# Altium project GUN.PrjPcb (part 1 of 2)
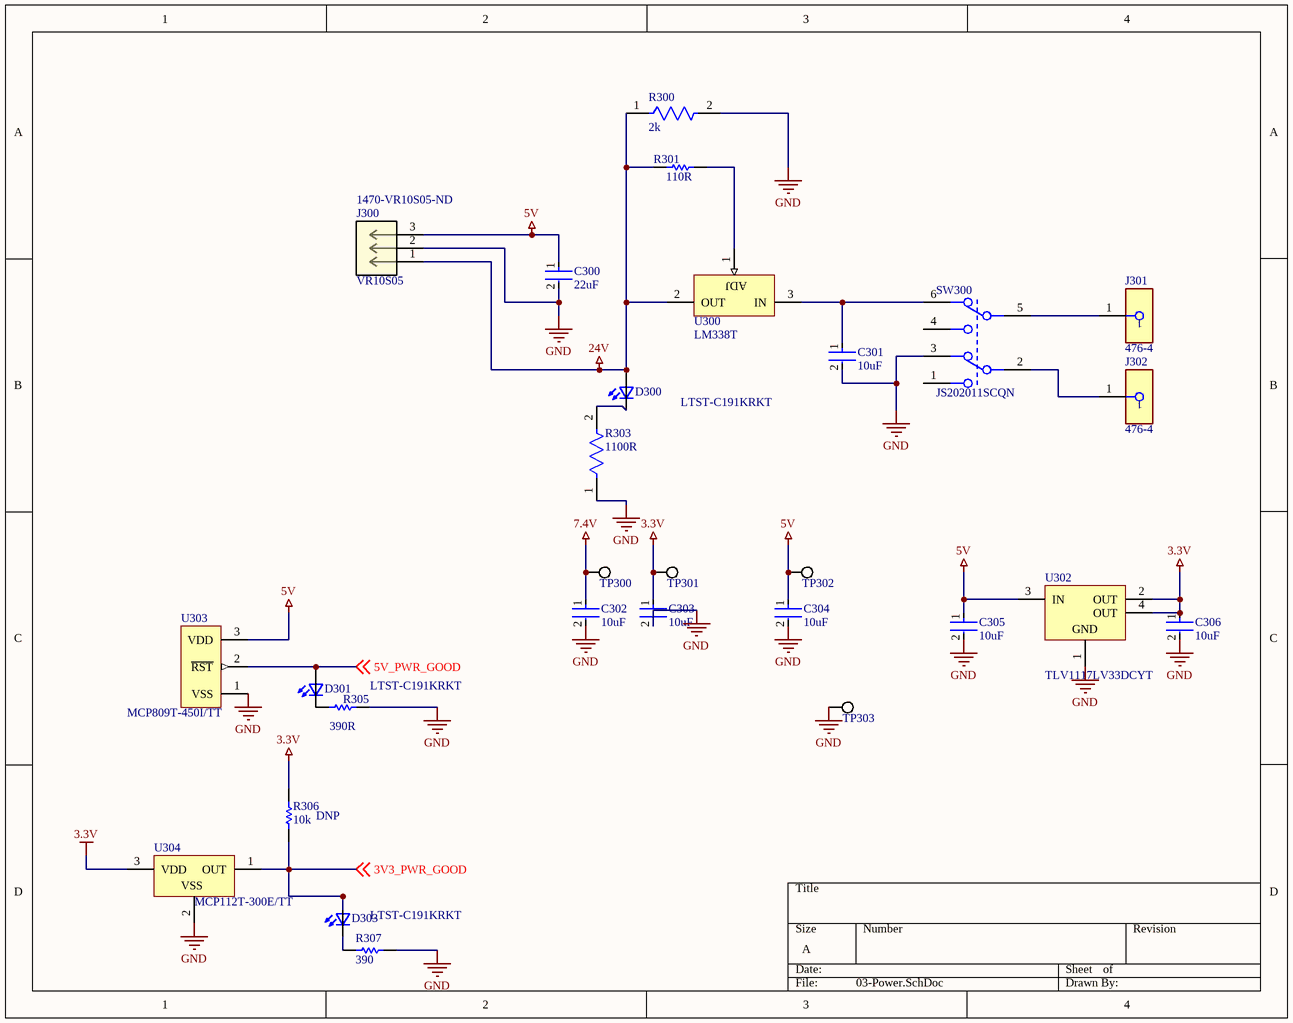
[diagram p0: 03-Power.SchDoc]
8 sheets, 146 parts. Net scope: flat (ports and power ports of the same name join across sheets).
Board file: GunPCB1.PcbDoc
Sheets:
  03-Power.SchDoc
  01-Revision_History_and_Contents.SchDoc
  02-MCU.SchDoc
  04-HallEffectSensor.SchDoc
  05-StepperMotor.SchDoc
  06-ServoMotor.SchDoc
  07-UARTBridge.SchDoc
  08-SwitchingRegulator.SchDoc

## Sheet 03-Power.SchDoc
size A

### Parts
C300  22uF  [FP-GRM21B-0_15-MFG]
C301  10uF  [FP-C0805C-DG-MFG]
C302  10uF  [FP-C0805C-DG-MFG]
C303  10uF  [FP-C0805C-DG-MFG]
C304  10uF  [FP-C0805C-DG-MFG]
C305  10uF  [FP-C0805C-DG-MFG]
C306  10uF  [FP-C0805C-DG-MFG]
D300  LTST-C191KRKT  [0603]
D301  LTST-C191KRKT  [0603]
D303  LTST-C191KRKT  [0603]
J300  VR10S05  Supplier Part Number 1: 1470-VR10S05-ND  [CONN3_10S05_XPP]
J301  476-4  [FP-476-4-MFG]
J302  476-4  [FP-476-4-MFG]
R300  2k  [FP-CRCW0805-e3-IPC_B]
R301  110R  [RESC2013X60X40NL20T25]
R303  1100R  [FP-ESR10-MFG]
R305  390R  [RESC3216X70X50LL05T20]
R306  10k  [RESC2013X60X35ML10T20]
R307  390  [RESC3216X70X50LL05T20]
SW300  JS202011SCQN  [FP-JS202011SCQN-MFG]
TP300  5019  [KSTN-5019_V]  (value not drawn)
TP301  5019  [KSTN-5019_V]  (value not drawn)
TP302  5019  [KSTN-5019_V]  (value not drawn)
TP303  5019  [KSTN-5019_V]  (value not drawn)
U300  LM338T  [NDE0003A]
U302  TLV1117LV33DCYT  [DCY0004A_M]
U303  MCP809T-450I/TT  [SOT-23-TT3_N]
U304  MCP112T-300E/TT  [SOT-23-TT3_L]

### Nets
3.3V: C303.1 C306.1 R306.2 TP301.1 U302.2(OUT) U302.4(OUT) U304.3(VDD)
5V: C300.1 C304.1 C305.1 J300.3 TP302.1 U302.3(IN) U303.3(VDD)
7.4V: C302.1 TP300.1
24V: D300.2(A2) J300.1 R300.1 R301.1 U300.2(OUT)
GND: C300.2 C301.2 C302.2 C303.2 C304.2 C305.2 C306.2 J300.2 R300.2 R303.1 R305.2 R307.1 SW300.3 TP303.1 U302.1(GND) U303.1(VSS) U304.2(VSS)
3V3_PWR_GOOD: D303.2(A2) R306.1 U304.1(OUT) ; off-sheet 3V3_PWR_GOOD
5V_PWR_GOOD: D301.2(A2) U303.2(~{RST}) ; off-sheet 5V_PWR_GOOD
NetC301_1: C301.1 SW300.6 U300.3(IN)
NetD300_1: D300.1(K2) R303.2
NetD301_1: D301.1(K2) R305.1
NetD303_1: D303.1(K2) R307.2
NetJ301_1: J301.1 SW300.5
NetJ302_1: J302.1 SW300.2
NetR301_2: R301.2 U300.1(ADJ)

Not connected (* = marked no-connect by the designer): SW300 1 4

### Notes on the sheet
- (near R306) DNP

### Library data of the parts
C300 = CMP-2007-03385-2: Manufacturer: Murata; Manufacturer Part Number: GRM21BR60J226ME39L; Material: Ceramic; Voltage: 6.3V; Dielectric: X5R; Tolerance: 20%; Max Operating Temperature: 85°C; Min Operating Temperature: -55°C; Case/Package: 0805; Thickness: 0.053inch; Packaging: Tape and Reel; Depth: 1.25mm; Termination: SMD/SMT; Voltage Rating (DC): 6.3V; Radiation Hardening: No; Mount: Surface Mount; Lead Free: Lead Free; Package Quantity: 1; REACH SVHC: No SVHC; Voltage Rating: 6.3V; Capacitance: 22uF; Length: 2mm; Case Code (Imperial): 0805; Case Code (Metric): 2012; Width: 0.049inch; Height: 1.25mm; Supplier 1: Digi-Key; Supplier Part Number 1: 490-1719-1-ND; RoHS: Yes; Category: Ceramic Capacitors; Stock 1: 2705091; Pricing 1: 1=0.37000, 10=0.25600, 50=0.17940, 100=0.15380, 500=0.11532, 1000=0.09739 (USD); Series: GRM; Construction: Flat; RoHS Compliant: Yes; Reach SVHC Compliant: Yes
C301-C306 = CMP-2007-03243-2: Manufacturer Part Number: C0805C106K8PACTU; Manufacturer: Kemet; 3DS Part Number: 220-00001; Tolerance: 10%; Temperature Coefficient: 15%; Material: Ceramic; Voltage: 10V; Temperature Characteristic: X5R; Device Class L2: Capacitors; Device Class L1: Passive Components; ComponentLink2URL: https://content.kemet.com/datasheets/KEM_C1006_X5R_SMD.pdf; Height: 1.4mm; Lead Free: Yes; Digikey Description: CAP CER 10UF 10V X5R 0805; Octopart: https://octopart.com/c0805c106k8pactu-kemet-98697; Capacitance: 10uF; Value: 10uF; Temperature Range Low: -55°C; Temperature: -55°C to +85°C; Automotive: No; Mouser Description: CAP CER 10UF 10V X5R 0805; Ipc Land Pattern Name: CAPC200125X125; Temperature Range High: +85°C; RoHS: TRUE; Device Class L3: Ceramic Capacitors; ComponentLink2Description: Datasheet; Voltage Rating: 10V; Package: C0805C-DG; Category: Cap
D300 D301 D303 = LTST-C191KRKT: http://octopart.com/ltst-c190krkt-lite-on-549893; Package: None; MP: LTST-C191KRKT; Value: *; Availability: Unavailable; Price: None; Supplier 1: Digi-Key; Supplier Part Number 1: 160-1447-1-ND
J300 = VR10S05: DC-DC Converter, Switching Regulater, 1A, SIP, VR Series; Mfr_Name: XP Power; RefDes: RefDes; Type: Type; Supplier 1: Digi-Key; Manufacturer: XP Power; Manufacturer Part Number: VR10S05; RoHS: No; Category: Board Mount Modules; Stock 1: 1761; Pricing 1: 1=2.85000, 5=2.76400, 10=2.67900, 25=2.56480, 100=2.39400 (USD)
J301 J302 = CMP-19636-000003-1: PLUG JACK MINI NON-INSULATED; Manufacturer: Keystone Electronics; Is Female: yes; Number Of Contacts: 1; Current Rating: 10A; Conn Orientation: Straight; Device Class L1: Connectors; Category: Conn; ComponentLink2Description: Datasheet; Lead Free: Yes; Device Class L3: unset; Package: 476-4; RoHS: TRUE; Contact Material: Tin; Footprint Url: https://www.keyelco.com/product-pdf.cfm?p=2378; Mouser Description: Test Plugs & Test Jacks BANANA JACK NON-INSUL; Octopart: https://octopart.com/476-4-keystone-225161; Device Class L2: unset; Manufacturer Part Number: 476-4; ComponentLink2URL: https://www.keyelco.com/userAssets/file/M65p111.pdf; Digikey Description: PLUG JACK MINI NON-INSULATED; Automotive: No
R300 = CMP-2001-03755-2: RES Thick Film, 2kΩ, 1%, 0.125W, 100ppm/°C, 0805; Working Voltage: 150V; Max Power Dissipation: 125mW; Resistance: 2kR; Package Quantity: 10; Case Code (Metric): 2012; Voltage Rating: 150V; Number of Terminations: 2; Max Operating Temperature: 155°C; Depth: 1.25mm; Tolerance: 1%; Power Rating: 125mW; Lead Free: Lead Free; Case/Package: 0805; Features: Automotive AEC-Q200; Min Operating Temperature: -55°C; Termination: SMD/SMT; Case Code (Imperial): 0805; Weight: 0.000194oz; Packaging: Tape and Reel; Military Standard: Not; Radiation Hardening: No; Contact Plating: Tin; Mount: Surface Mount; Temperature Coefficient: 100ppm/°C; Height: 0.02inch; Number of Terminals: 2; Voltage Rating (DC): 150V; Number of Pins: 2; Length: 2mm; Width: 1.25mm; Composition: Thick Film
R301 = CMP-2001-00585-1: Part Number: ERA6AEB111V; Manufacturer: Panasonic
R303 = CMP-08839-007508-1: 1.1kΩ ±1% 0.4W 0805 Anti-Surge Chip Resistor AEC-Q200; Max Power Dissipation: 400mW; Temperature Coefficient: 100ppm/°C; Resistance: 1.1kR; Size Code: 0805; Case/Package: 0805; Resistor Type: Thick Film; Lead Free: Lead Free; Max Operating Temperature: 155°C; Package Quantity: 1; Power Rating: 400mW; Series: ESR; Number of Terminations: 2; Height: 0.026inch; Features: Automotive AEC-Q200; Case Code (Metric): 2012; Width: 0.049inch; Length: 0.079inch; Tolerance: 1%; Case Code (Imperial): 0805; Packaging: Tape and Reel; RoHS Compliant: Yes; Min Operating Temperature: -55°C
R305 R307 = CMP-1014-00463-2: Manufacturer: Panasonic; Part Number: ERJ8ENF3900V
R306 = CMP-2000-05025-1: Chip Resistor, 10 KOhm, +/- 5%, 0.125 W, -55 to 155 degC, 0805 (2012 Metric), RoHS, Tape and Reel; Manufacturer: Yageo; Resistor Element Type: ThickFilm; Voltage Rating: 150V; Product Range: RCSeries; SVHC: ToBeAdvised; Resistor Case Style: 0805[2012Metric]; Temperature Coefficient: ±100ppm/degC; Power Rating: 250mW; Resistance: 10kohm; Automotive Qualification Standard: -; Datasheet Version: REV. 2, 09/2004; Packaging: CutTape; Resistance Tolerance: ±5%; MSL: MSL1-Unlimited; Manufacturer URL: http://www.yageo.com/; Datasheet URL: http://www.yageo.ru/pdf/RC0805.pdf; Package Description: 2-Pin Surface Mounted Device, Body 2 x 1.25 mm; Package Reference: 805
SW300 = CMP-2000-05087-3: SWITCH SLIDE DPDT 300MA 6V; Switch Function: On-On; Actuator Type: Standard; Switch Travel: 2mm; Actuator Color: Black; Contact Resistance: 70mR; Electrical Life: 5000Cycles; Actuator Material: Nylon; REACH SVHC: No SVHC; Series: JS; Min Operating Temperature: -20°C; Depth: 7.5mm; Housing Material: Nylon; Voltage Rating (DC): 6V; Max Operating Temperature: 85°C; Contact Current Rating: 300mA; Package Quantity: 1; Contact Plating: Silver; Contact Material: Copper Alloy; Throw Configuration: DPDT; Current Rating: 300mA; Orientation: Vertical; Max Current Rating: 300mA; Max Voltage Rating (DC): 6V; Flammability Rating: UL94 V-2; Length: 9mm; Packaging: Tape and Reel; Mount: Surface Mount; Actuator Length: 2mm; Lead Free: Lead Free; Termination: Gull Wing; Radiation Hardening: No
TP300-TP303 = CMP-1672-00008-1: Test Point, 1 Position SMD, RoHS, Tape and Reel; Manufacturer 1: Keystone Electronics; ComponentLink1Description: Manufacturer URL; Package Quantity: 1000; DatasheetVersion: 03/2014; Packaging: Tape and Reel; ComponentLink2URL: http://www.keyelco.com/product-pdf.cfm?p=1357; ComponentLink1URL: http://www.keyelco.com/; Mount: Surface Mount; Contact Plating: Silver; PackageDescription: 1-Pin Surface Mount Device, Body 3.81 x 2.03 mm; Pins: 1; RoHSCompliant: True; Mounting Technology: Surface Mount; ComponentLink2Description: Datasheet; PackageReference: 5019; Supplier 1: Digi-Key; Supplier Part Number 1: 36-5019CT-ND; Manufacturer Part Number 1: 5019; RoHS: Yes; Category: Connectors; Stock 1: 1316816; Pricing 1: 1=0.34000, 25=0.27360, 100=0.22340, 250=0.20064, 500=0.19152 (USD); Number of Pins: 1; Material: Bronze; Contact Material: Bronze; Series: 5019; Termination: SMD/SMT; Height: 0.09inch; RoHS Compliant: Yes; REACH SVHC: No SVHC; Lead Free: Lead Free; ComponentLink3URL: https://datasheet.ciiva.com/16318/m60-2p61-16318395.pdf?src-supplier=Future+Electronics; ComponentLink3Description: https://datasheet.ciiva.com/16318/m60-2p61-16318395.pdf?src-supplier=Future+Electronics; ComponentLink4URL: https://datasheet.ciiva.com/16885/70182998-16885945.pdf?src-supplier=Allied+Electronics; ComponentLink4Description: https://datasheet.ciiva.com/16885/70182998-16885945.pdf?src-supplier=Allied+Electronics; ComponentLink5URL: https://datasheet.ciiva.com/14848/m60-2p61-14848437.pdf?src-supplier=Digi-Key; ComponentLink5Description: https://datasheet.ciiva.com/14848/m60-2p61-14848437.pdf?src-supplier=Digi-Key; ComponentLink6URL: https://datasheet.ciiva.com/14848/m60-2p61-14848438.pdf?src-supplier=Digi-Key; ComponentLink6Description: https://datasheet.ciiva.com/14848/m60-2p61-14848438.pdf?src-supplier=Digi-Key; ComponentLink7URL: https://datasheet.ciiva.com/14848/m60-2p61-14848439.pdf?src-supplier=Digi-Key; ComponentLink7Description: https://datasheet.ciiva.com/14848/m60-2p61-14848439.pdf?src-supplier=Digi-Key
U300 = CMP-0062-02475-3: 5 Amp Adjustable Regulator, 3-pin TO-220; Manufacturer: Texas Instruments; PowerWise: N; PackageTopMarking: NSUZXYTTE#*LM338T P+; CompType: LDO IC; RoHS: N; PackageDescription: TO-220, Molded, 3 Lead, Straight; PinCount: 3; ComponentLink1URL: http://www.ti.com/general/docs/lit/getliterature.tsp?genericPartNumber=LM338&fileType=pdf; ComponentLink1Description: Datasheet URL; PackageReference: NDE0003A
U302 = CMP-0395-00499-2: Single Output LDO, 1 A, Fixed 3.3 V Output, 2 to 5.5 V Input, 4-pin SOT-223 (DCY), -40 to 125 degC, Green (RoHS & no Sb/Br); Manufacturer: Texas Instruments; Vout Adj(Max)(V): 3.3; Iout(Max)(A): 1; SubFamily: Single Channel LDO; Iq(Typ)(mA): 0.05; Accuracy(%): 2; Vin(Max)(V): 5.5; Vdo(Typ)(mV): 1200; PartNumber: TLV1117LV33DCYT; PackageReference: DCY0004A; PackageVersion: 4202506/B; ComponentLink1URL: http://www.ti.com/; DatasheetVersion: SBVS160A; Mounting Technology: Surface Mount; Fixed Output Options(V): 3.3; ComponentLink3Description: Package Specification; PackageDescription: 4-Pin Plastic Small Outline, Body 3.5 x 6.5 mm, Pitch 2.3 mm; Vout Adj(Min)(V): 3.3; ComponentLink2URL: http://www.ti.com/general/docs/lit/getliterature.tsp?genericPartNumber=TLV1117LV33&fileType=pdf; Code_JEDEC: TO-261; ComponentLink1Description: Manufacturer URL; Vin(Min)(V): 2; ComponentLink2Description: Datasheet; Eco-Plan: Green (RoHS & no Sb/Br); ComponentLink3URL: http://www.ti.com/litv/pdf/mpds094a
U303 = CMP-0138-00383-1: Microcontroller Supervisory Circuit with Push-Pull Output, 3-Pin SOT-23, Industrial Temperature, Tape and Reel; DatasheetVersion: revC, 2001; PackageReference: SOT-23-TT3; Code_IPC: SOT23-3; PackageVersion: revBB, Aug-2009; PackageDescription: 3-Lead Plastic Small Outline Transistor (TT) [SOT-23]
U304 = CMP-0130-00043-1: 1.75Î¼A Micropower Voltage Detector, Push-Pull Output, 2.93V, 3-Pin SOT-23, Extended Temperature, Tape and Reel; Code_IPC: SOT23-3; DatasheetVersion: revD, Jun-2005; PackageVersion: revBB, Aug-2009; PackageDescription: 3-Lead Plastic Small Outline Transistor (TT) [SOT-23]; PackageReference: SOT-23-TT3

## Sheet 01-Revision_History_and_Contents.SchDoc: Revision History and Contents
size A; Date: 4/25/2017; ApprovedBy: JSK; CheckedBy: JSK; Author: JSK; CompanyName: University of Wisconsin; DrawnBy: JSK; Engineer: JSK; Organization: ECE 315; Address1: College of Engineering; Address2: 1415 Engineering Drive; Address3: Madison, WI 53706; Address4: ECE 453 Spring 2017; Revision: A; SheetNumber: 1; SheetTotal: 2
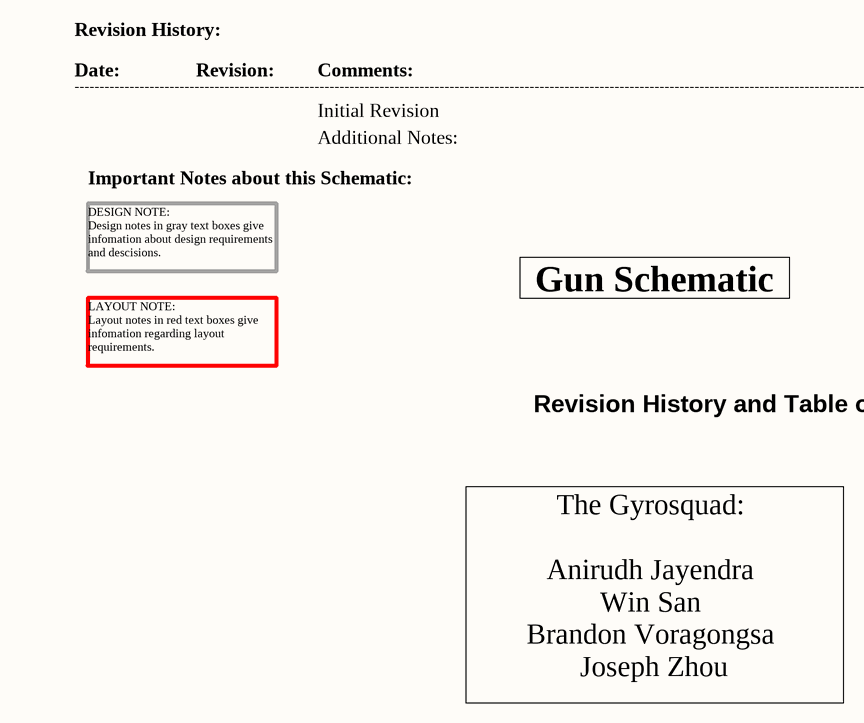
[diagram p1: 01-Revision_History_and_Contents.SchDoc]

### Notes on the sheet
- Revision History:
- Date:
- ----------------------------------------------------------------------------------------------------------------------------------------------------------------------
- Revision:
- Comments:
- Initial Revision
- Important Notes about this Schematic:
- Additional Notes:
- DESIGN NOTE:
  Design notes in gray text boxes give infomation about design requirements and descisions.
- Gun Schematic
- LAYOUT NOTE:
  Layout notes in red text boxes give infomation regarding layout requirements.
- Revision History and Table of Contents
- The Gyrosquad:
  Anirudh Jayendra
  Win San
  Brandon Voragongsa
  Joseph Zhou

## Sheet 02-MCU.SchDoc: ECE453 Power
size A; Date: 4/25/2017; ApprovedBy: JSK; CheckedBy: JSK; Author: JSK; CompanyName: University of Wisconsin; DrawnBy: JSK; Engineer: JSK; Organization: ECE 315; Address1: College of Engineering; Address2: 1415 Engineering Drive; Address3: Madison, WI 53706; Address4: ECE 453 Fall 2022; Revision: A; SheetNumber: 2; SheetTotal: 2; AssemblyNumber: ECE453-F22-01
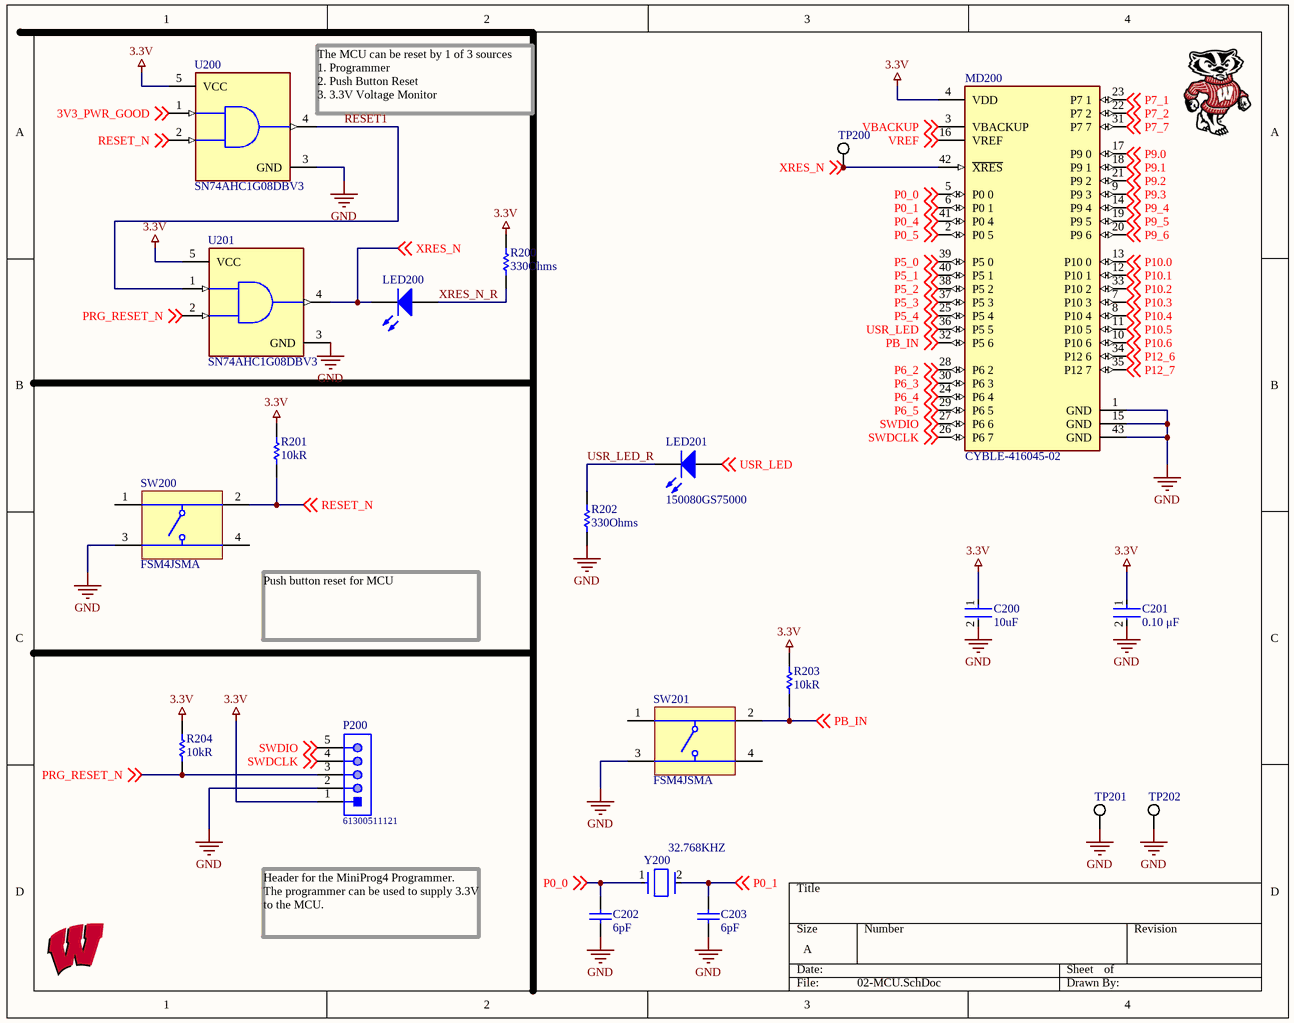
[diagram p2: 02-MCU.SchDoc]

### Parts
C200  value 10uF  [FP-C0805C-DG-MFG]  (hidden comment: C0805C106K8PACTU)
C201  value 0.10 μF  [FP-C0805C-DN-MFG]  (hidden comment: C0805C104K5RACTU)
C202  Capacitance: 6pF  [CAPC2013X94X50LL20T25]  (hidden comment: 08055A6R0CAT2A)
C203  Capacitance: 6pF  [CAPC2013X94X50LL20T25]  (hidden comment: 08055A6R0CAT2A)
LED200  150080RS75000  [0805_A]  (value not drawn)
LED201  150080GS75000  [0805_A]
MD200  CYBLE-416045-02  [FP-CYBLE-416045-02-MFG]
P200  61300511121  [61300511121]
R200  Resistance: 330Ohms  [RESC2013X60X35LL10T20]  (hidden comment: RC0805FR-07330RL)
R201  Resistance: 10kR  [RESC2013X60X35NL10T20]  (hidden comment: RC0805FR-0710KL)
R202  Resistance: 330Ohms  [RESC2013X60X35LL10T20]  (hidden comment: RC0805FR-07330RL)
R203  Resistance: 10kR  [RESC2013X60X35NL10T20]  (hidden comment: RC0805FR-0710KL)
R204  Resistance: 10kR  [RESC2013X60X35NL10T20]  (hidden comment: RC0805FR-0710KL)
SW200  FSM4JSMA  [TECO-FSM4JSMA_V]
SW201  FSM4JSMA  [TECO-FSM4JSMA_V]
TP200  5019  [KSTN-5019_V]  (value not drawn)
TP201  5019  [KSTN-5019_V]  (value not drawn)
TP202  5019  [KSTN-5019_V]  (value not drawn)
U200  SN74AHC1G08DBV3  [FP-DBV0005A-IPC_C]
U201  SN74AHC1G08DBV3  [FP-DBV0005A-IPC_C]
Y200  32.768KHZ  [FP-ABS07-120-MFG]

### Nets
3.3V: C200.1 C201.1 MD200.4(VDD) P200.1 R200.2 R201.2 R203.2 R204.2 U200.5(VCC) U201.5(VCC)
GND: C200.2 C201.2 C202.1 C203.1 MD200.1(GND) MD200.15(GND) MD200.43(GND) P200.2 R202.1 SW200.3 SW201.3 TP201.1 TP202.1 U200.3(GND) U201.3(GND)
3V3_PWR_GOOD: U200.1(A) ; off-sheet 3V3_PWR_GOOD
P0_0: C202.2 MD200.5(P0_0) Y200.1 ; off-sheet P0_0
P0_1: C203.2 MD200.6(P0_1) Y200.2 ; off-sheet P0_1
P0_4: MD200.41(P0_4) ; off-sheet P0_4
P0_5: MD200.2(P0_5) ; off-sheet P0_5
P5_0: MD200.39(P5_0) ; off-sheet P5_0
P5_1: MD200.40(P5_1) ; off-sheet P5_1
P5_2: MD200.38(P5_2) ; off-sheet P5_2
P5_3: MD200.37(P5_3) ; off-sheet P5_3
P5_4: MD200.25(P5_4) ; off-sheet P5_4
P6_2: MD200.28(P6_2) ; off-sheet P6_2
P6_3: MD200.30(P6_3) ; off-sheet P6_3
P6_4: MD200.24(P6_4) ; off-sheet P6_4
P6_5: MD200.29(P6_5) ; off-sheet P6_5
P7_1: MD200.23(P7_1) ; off-sheet P7_1
P7_2: MD200.22(P7_2) ; off-sheet P7_2
P7_7: MD200.31(P7_7) ; off-sheet P7_7
P9.0: MD200.17(P9_0) ; off-sheet P9.0
P9.1: MD200.18(P9_1) ; off-sheet P9.1
P9.2: MD200.21(P9_2) ; off-sheet P9.2
P9.3: MD200.9(P9_3) ; off-sheet P9.3
P9_4: MD200.14(P9_4) ; off-sheet P9_4
P9_5: MD200.19(P9_5) ; off-sheet P9_5
P9_6: MD200.20(P9_6) ; off-sheet P9_6
P10.0: MD200.13(P10_0) ; off-sheet P10.0
P10.1: MD200.12(P10_1) ; off-sheet P10.1
P10.2: MD200.33(P10_2) ; off-sheet P10.2
P10.3: MD200.7(P10_3) ; off-sheet P10.3
P10.4: MD200.8(P10_4) ; off-sheet P10.4
P10.5: MD200.11(P10_5) ; off-sheet P10.5
P10.6: MD200.10(P10_6) ; off-sheet P10.6
P12_6: MD200.34(P12_6) ; off-sheet P12_6
P12_7: MD200.35(P12_7) ; off-sheet P12_7
PB_IN: MD200.32(P5_6) R203.1 SW201.2 ; off-sheet PB_IN
PRG_RESET_N: P200.3 R204.1 U201.2(B) ; off-sheet PRG_RESET_N
RESET1: U200.4(Y) U201.1(A)
RESET_N: R201.1 SW200.2 U200.2(B) ; off-sheet RESET_N
SWDCLK: MD200.26(P6_7) P200.4 ; off-sheet SWDCLK
SWDIO: MD200.27(P6_6) P200.5 ; off-sheet SWDIO
USR_LED: LED201.2(A) MD200.36(P5_5) ; off-sheet USR_LED
USR_LED_R: LED201.1(K) R202.2
VBACKUP: MD200.3(VBACKUP) ; off-sheet VBACKUP
VREF: MD200.16(VREF) ; off-sheet VREF
XRES_N: LED200.1(K) MD200.42(~{XRES}) TP200.1 U201.4(Y) ; off-sheet XRES_N
XRES_N_R: LED200.2(A) R200.1

Not connected (* = marked no-connect by the designer): SW200 1 4; SW201 1 4

### Notes on the sheet
- (near U200) The MCU can be reset by 1 of 3 sources
  1. Programmer
  2. Push Button Reset
  3. 3.3V Voltage Monitor
- (near SW200) Push button reset for MCU
- Header for the MiniProg4 Programmer.  The programmer can be used to supply 3.3V to the MCU.

### Library data of the parts
C200 = CMP-2007-03243-2: CAP CER 10UF 10V X5R 0805; Manufacturer: Kemet; 3DS Part Number: 220-00001; Tolerance: 10%; Temperature Coefficient: 15%; Material: Ceramic; Device Class L2: Capacitors; Device Class L1: Passive Components; ComponentLink2URL: https://content.kemet.com/datasheets/KEM_C1006_X5R_SMD.pdf; Height: 1.4mm; Lead Free: Yes; Manufacturer Part Number: C0805C106K8PACTU; Digikey Description: CAP CER 10UF 10V X5R 0805; Octopart: https://octopart.com/c0805c106k8pactu-kemet-98697; Capacitance: 10uF; Temperature Range Low: -55°C; Temperature: -55°C to +85°C; Automotive: No; Mouser Description: CAP CER 10UF 10V X5R 0805; Ipc Land Pattern Name: CAPC200125X125; Temperature Range High: +85°C; Voltage: 10V; RoHS: TRUE; Device Class L3: Ceramic Capacitors; ComponentLink2Description: Datasheet; Voltage Rating: 10V; Package: C0805C-DG; Temperature Characteristic: X5R; Category: Cap; Supplier 1: Digi-Key; Supplier Part Number 1: 399-C0805C106K8PAC7800CT-ND; Manufacturer 1: KEMET; Manufacturer Part Number 1: C0805C106K8PACTU; Stock 1: 8631846; Pricing 1: 1=0.14000, 10=0.10300, 50=0.05840, 100=0.04830, 500=0.03388, 1000=0.02805 (USD); Mount: Surface Mount; Case/Package: 0805; Number of Pins: 2; Case Code (Imperial): 0805; Case Code (Metric): 2012; Dielectric Material: Ceramic; Contact Plating: Tin,Matte; Min Operating Temperature: -55°C; Max Operating Temperature: 85°C; Packaging: Tape and Reel; Dielectric: X5R; Package Quantity: 1; Voltage Rating (DC): 10V; Series: C; Termination: SMD/SMT; Construction: Flat; Dissipation Factor: 10%; Length: 2mm; Width: 1.2mm; Depth: 1.25mm; Thickness: 0.055inch; Radiation Hardening: No; REACH SVHC: No SVHC; RoHS Compliant: Yes
C201 = CMP-2007-00279-2: CAP CER 0.1UF 50V X7R 0805; Manufacturer: KEMET; Tolerance: 0.1; Temperature Coefficient: 30ppm/°C; Material: Ceramic; Voltage: 500V; Manufacturer Part Number: C0805C104K5RACTU; Device Class L2: Capacitors; Temperature Range Low: -55°C; Voltage Rating: 50 V; Digikey Description: CAP CER 0.1UF 50V X7R 0805; Category: Cap; ComponentLink2Description: Datasheet; Octopart: https://octopart.com/c0805c104k5ractu-kemet-143926; RoHS: TRUE; ComponentLink2URL: https://content.kemet.com/datasheets/KEM_C1003_C0G_SMD.pdf; Temperature Characteristic: X7R; Temperature: -55°C to +125°C; Height: 0.88mm; Temperature Range High: +125°C; Device Class L1: Passive Components; Automotive: No; Lead Free: Yes; Ipc Land Pattern Name: CAPC200125X78; Device Class L3: Ceramic Capacitors; Mouser Description: Cap Ceramic 0.1uF 50V X7R 10% SMD 2.0 x 1.2 mm 125 C Paper T/R; Capacitance: 0.10 μF; Package: C0805C-DN; Supplier 1: Digi-Key; Supplier Part Number 1: 399-C0805C104K5RAC7800CT-ND; Manufacturer 1: KEMET; Manufacturer Part Number 1: C0805C104K5RACTU; Stock 1: 2903712; Pricing 1: 1=0.14000, 10=0.09700, 50=0.05480, 100=0.04540, 500=0.03182, 1000=0.02634 (USD); Mount: Surface Mount,PCB; Case/Package: 0805; Number of Pins: 2; Case Code (Imperial): 0805; Case Code (Metric): 2012; Dielectric Material: Ceramic; Contact Plating: Tin,Matte; Min Operating Temperature: -55°C; Max Operating Temperature: 125°C; Package Quantity: 4000; Packaging: Tape and Reel; Dielectric: X7R; Voltage Rating (DC): 50V; Termination: SMD/SMT; Series: C0805C; Construction: Flat; Length: 2mm; Width: 1.2mm; Depth: 1.25mm; Thickness: 0.035inch; Lead Pitch: 0.75mm; Radiation Hardening: No; RoHS Compliant: Yes; REACH SVHC: No SVHC
C202 C203 = CMP-2007-04344-1: Manufacturer: AVX Interconnect / Elco; Manufacturer 1: Kyocera AVX; Voltage Rating: 50V; Dielectric: C0G; Part Number: 08055A6R0CAT2A; Supplier 1: Digi-Key; Supplier Part Number 1: 478-11894-1-ND; Manufacturer Part Number 1: 08055A6R0CAT2A; RoHS: Yes; Category: Ceramic Capacitors; Stock 1: 19844; Pricing 1: 1=0.24000, 10=0.16700, 50=0.10000, 100=0.08440, 500=0.05778, 1000=0.05111 (USD); Mount: Surface Mount; Case/Package: 0805; Case Code (Metric): 2012; Case Code (Imperial): 0805; Min Operating Temperature: -55°C; Max Operating Temperature: 125°C; Package Quantity: 4000; Packaging: Tape and Reel; Voltage Rating (DC): 50V; Termination: SMD/SMT; Series: -; Construction: Flat; Length: 2.01mm; Width: 0.049inch; Thickness: 0.037inch; Depth: 1.25mm; Radiation Hardening: No; RoHS Compliant: Yes; ComponentLink1URL: https://datasheet.ciiva.com/205/ccog-205395.pdf?src-supplier=Digi-Key; ComponentLink1Description: https://datasheet.ciiva.com/205/ccog-205395.pdf?src-supplier=Digi-Key; ComponentLink2URL: https://datasheet.ciiva.com/11499/ccog-11499893.pdf?src-supplier=Avnet; ComponentLink2Description: https://datasheet.ciiva.com/11499/ccog-11499893.pdf?src-supplier=Avnet; ComponentLink3URL: https://datasheet.ciiva.com/5424/ccog-5424575.pdf?src-supplier=Mouser; ComponentLink3Description: https://datasheet.ciiva.com/5424/ccog-5424575.pdf?src-supplier=Mouser
LED200 = CMP-1426-00011-1: SMD mono-color Chip LED, WL-SMCW, Red; Manufacturer: Wuerth Elektronik; Manufacturer 1: Wurth Electronics; Luminous Intensity: 150mcd; Viewing Angle: 140°; Forward Voltage: 2V; Lens Style: Clear,Rectangular; Forward Current: 30mA; Dominant Wavelength: 625nm; Test Current: 20mA; Color: Red; PartNumber: 150080RS75000; PackageReference: 0805_A; ComponentLink2Description: Datasheet; ComponentLink1URL: http://www.we-online.com; ComponentLink1Description: Manufacturer URL; ComponentLink2URL: http://katalog.we-online.com/led/datasheet/150080RS75000.pdf; Supplier 1: Digi-Key; Supplier Part Number 1: 732-4984-1-ND; Manufacturer Part Number 1: 150080RS75000; RoHS: Yes; Category: LEDs; Stock 1: 100282; Pricing 1: 1=0.19000, 50=0.17600, 100=0.15100, 500=0.13100 (USD); Mount: Surface Mount; Case/Package: 0805; Case Code (Metric): 2012; Case Code (Imperial): 0805; Min Operating Temperature: -40°C; Max Operating Temperature: 85°C; Packaging: Tape and Reel; Wavelength: 625nm; Package Quantity: 4000; Length: 2mm; Width: 1.25mm; Height: 0.7mm; RoHS Compliant: Yes; REACH SVHC: Unknown; ComponentLink3URL: https://datasheet.ciiva.com/22656/150080rs75000-22656961.pdf?src-supplier=Element14; ComponentLink3Description: https://datasheet.ciiva.com/22656/150080rs75000-22656961.pdf?src-supplier=Element14; ComponentLink4URL: https://datasheet.ciiva.com/29279/759435-da-01-en-chipled-0805-w-kl-rot-150080rs75000-29279032.pdf?src-supplier=Conrad; ComponentLink4Description: https://datasheet.ciiva.com/29279/759435-da-01-en-chipled-0805-w-kl-rot-150080rs75000-29279032.pdf?src-supplier=Conrad
LED201 = CMP-1426-00007-1: SMD mono-color Chip LED, WL-SMCW, Green; Manufacturer: Wuerth Elektronik; Manufacturer 1: Wurth Electronics; Viewing Angle: 140°; Lens Style: Clear,Rectangular; Luminous Intensity: 450mcd; Forward Voltage: 3.2V; Wavelength: 520nm; Forward Current: 30mA; Test Current: 20mA; PackageReference: 0805_A; Color: Green; PartNumber: 150080GS75000; ComponentLink2URL: http://katalog.we-online.com/led/datasheet/150080GS75000.pdf; ComponentLink1URL: http://www.we-online.com; ComponentLink1Description: Manufacturer URL; ComponentLink2Description: Datasheet; Supplier 1: Digi-Key; Supplier Part Number 1: 732-4983-1-ND; Manufacturer Part Number 1: 150080GS75000; RoHS: Yes; Category: LEDs; Stock 1: 95801; Pricing 1: 1=0.19000, 50=0.17600, 100=0.15100, 500=0.13100 (USD); Mount: Surface Mount; Case/Package: 0805; Case Code (Metric): 2012; Case Code (Imperial): 0805; Min Operating Temperature: -40°C; Max Operating Temperature: 85°C; Package Quantity: 4000; Packaging: Cut Tape; Dominant Wavelength: 520nm; Length: 2mm; Width: 1.25mm; Height: 0.7mm; REACH SVHC: Unknown; RoHS Compliant: Yes; ComponentLink3URL: https://datasheet.ciiva.com/29563/150080gs75000-29563008.pdf?src-supplier=Digi-Key; ComponentLink3Description: https://datasheet.ciiva.com/29563/150080gs75000-29563008.pdf?src-supplier=Digi-Key; ComponentLink4URL: https://datasheet.ciiva.com/29279/759434-da-01-en-chipled-0805-w-kl-gruen-150080gs75000-29279039.pdf?src-supplier=Conrad; ComponentLink4Description: https://datasheet.ciiva.com/29279/759434-da-01-en-chipled-0805-w-kl-gruen-150080gs75000-29279039.pdf?src-supplier=Conrad
MD200 = CMP-12964-000002-1: RF TXRX MOD BLUETOOTH TRACE ANT; Manufacturer: Cypress Semiconductor; Manufacturer 1: Cypress; Number Of Gpio: 36; Number Of Adc Channels: 1; Max Supply Voltage: 3.6V; Min Supply Voltage: 1.71V; Data Rate: 2Mbits/s; Receiving Current: 6.7mA; Max Frequency: 2.5GHz; Bandwidth: 100MHz; Transmitting Current: 5.7mA; Interface: I2C,SPI,UART,I2S,Other; Octopart: https://octopart.com/cyble-416045-02-cypress+semiconductor-96386825; Lead Free: Yes; RoHS: TRUE; Device Class L3: Transceivers; Category: UNK; Package: 0; Device Class L2: RF Semiconductors and Devices; Automotive: No; ComponentLink2URL: https://www.cypress.com/file/428336/download; Temperature Range Low: -40°C; Height: 2mm; Device Class L1: Integrated Circuits (ICs); Manufacturer Part Number: CYBLE-416045-02; ComponentLink2Description: Datasheet; Digikey Description: RF TXRX MOD BLUETOOTH TRACE ANT; Temperature: -40°C to +85°C; Temperature Range High: +85°C; Supplier 1: Digi-Key; Supplier Part Number 1: 428-4622-1-ND; Manufacturer Part Number 1: CYBLE-416045-02; Stock 1: 3441; Pricing 1: 1=16.24000, 10=14.69300, 25=13.53280, 100=12.37280, 250=11.59952 (USD); RoHS Compliant: Yes
P200 = CMP-1502-01068-1: THT Vertical Pin Header WR-PHD, Pitch 2.54 mm, Single Row, 5 pins; Manufacturer: Wurth Elektronik; Manufacturer 1: Wurth Electronics; Pin Number: 5; Contact Resistance: 20mOhm; Working Voltage: 250VAC; Pitch: 2.54mm; Withstanding Voltage: 500VAC; Rated Current: 3A; Gender: Male; Connector Type: Male Pin; Datasheet URL: https://katalog.we-online.de/em/datasheet/6130xx11121.pdf; Orientation: Vertical; Mounting Technology: THT; Row Number: Single; Package Reference: 61300511121; Publisher: WurthElektronik; Part Number: 61300511121; Packaging: Bag; Manufacturer URL: http://www.we-online.de; Operating Temperature: -40to105degC; Supplier 1: Digi-Key; Supplier Part Number 1: 732-5318-ND; Manufacturer Part Number 1: 61300511121; RoHS: Yes; Category: Headers and Wire Housings; Stock 1: 41302; Pricing 1: 1=0.26000, 10=0.22200, 25=0.18520, 50=0.15500, 100=0.14100, 1000=0.12800 (USD); Mount: Through Hole; Contact Plating: Gold; Contact Material: Copper; Color: Black; Number of Rows: 1; Termination: Solder; Number of Contacts: 5; Number of Positions: 5; Contact Mating Length: 0.236inch; RoHS Compliant: Yes; REACH SVHC: Unknown; Lead Free: Lead Free; ComponentLink1URL: http://www.farnell.com/cad/1737268.pdf?src-supplier=Element14; ComponentLink1Description: http://www.farnell.com/cad/1737268.pdf?src-supplier=Element14; ComponentLink2URL: https://katalog.we-online.de/em/datasheet/6130xx11121.pdf?src-supplier=Digi-Key; ComponentLink2Description: https://katalog.we-online.de/em/datasheet/6130xx11121.pdf?src-supplier=Digi-Key
R200 R202 = CMP-2000-06960-1: Chip Resistor, 330 Ohm, +/- 1%, 125 mW, -55 to 155 degC, 0805 (2012 Metric), RoHS, Tape and Reel; Manufacturer: Yageo; Voltage Rating: 150V; Temperature Coefficient: 100PPM/C; Power Rating: 125mW(1/8W); Max Power Dissipation: 125mW; Datasheet Version: Rev. 7, 05/2017; Termination Style: SMD/SMT; Case Code - mm: 2012; Package Description: 2-Pin Surface Mounted Device, Body 2 x 1.25 mm; Operating Temperature Range: -55Cto+155C; Case Code - in: 0805; Packaging: Reel; Tolerance: 1%; Package Reference: 0805; Mounting Technology: SurfaceMount; Product: ThickFilmResistorsGeneralPurpose; Series: RC; Manufacturer URL: http://www.yageo.com/; Datasheet URL: http://www.yageo.com/documents/recent/PYu-RC_Group_51_RoHS_L_7.pdf; Supplier 1: Digi-Key; Supplier Part Number 1: 311-330CRCT-ND; Manufacturer 1: Yageo; Manufacturer Part Number 1: RC0805FR-07330RL; RoHS: Yes; Category: Chip SMD Resistors; Stock 1: 1406392; Pricing 1: 1=0.10000, 10=0.03800, 100=0.01560, 1000=0.00699, 2500=0.00607 (USD); Case/Package: 0805; Case Code (Imperial): 0805; Case Code (Metric): 2012; Size Code: 0805; Min Operating Temperature: -55°C; Max Operating Temperature: 155°C; Package Quantity: 5000; Construction: Rectangular; Resistor Type: Thick Film; Number of Terminations: 2; Termination: SMD/SMT; Features: Moisture Resistant; Resistance Tolerance: 1%; Length: 2mm; Width: 0.049inch; Height: 0.024inch; Depth: 1.25mm; RoHS Compliant: Yes; Military Standard: Not; REACH SVHC: Unknown; Lead Free: Lead Free; ComponentLink1URL: https://datasheet.ciiva.com/2457/pyu-r-int-thick-7-2457015.pdf?src-supplier=Digi-Key; ComponentLink1Description: https://datasheet.ciiva.com/2457/pyu-r-int-thick-7-2457015.pdf?src-supplier=Digi-Key; ComponentLink2URL: https://datasheet.ciiva.com/2457/pyu-r-int-thick-7-2457016.pdf?src-supplier=Digi-Key; ComponentLink2Description: https://datasheet.ciiva.com/2457/pyu-r-int-thick-7-2457016.pdf?src-supplier=Digi-Key; ComponentLink3URL: https://datasheet.ciiva.com/2457/pyu-r-int-thick-7-2457014.pdf?src-supplier=Digi-Key; ComponentLink3Description: https://datasheet.ciiva.com/2457/pyu-r-int-thick-7-2457014.pdf?src-supplier=Digi-Key; ComponentLink4URL: https://datasheet.ciiva.com/12667/rc0805-12667925.pdf?src-supplier=Mouser; ComponentLink4Description: https://datasheet.ciiva.com/12667/rc0805-12667925.pdf?src-supplier=Mouser; ComponentLink5URL: https://datasheet.ciiva.com/7941/444164-7941768.pdf?src-supplier=Element14; ComponentLink5Description: https://datasheet.ciiva.com/7941/444164-7941768.pdf?src-supplier=Element14; ComponentLink6URL: https://datasheet.ciiva.com/7941/444164-7941769.pdf?src-supplier=Element14; ComponentLink6Description: https://datasheet.ciiva.com/7941/444164-7941769.pdf?src-supplier=Element14; ComponentLink7URL: https://datasheet.ciiva.com/16740/rc0805-16740975.pdf?src-supplier=Future+Electronics; ComponentLink7Description: https://datasheet.ciiva.com/16740/rc0805-16740975.pdf?src-supplier=Future+Electronics
R201 R203 R204 = CMP-1659-00013-4: Chip Resistor, 10 KOhm, +/- 1%, 0.125 W, -55 to 155 degC, 0805 (2012 Metric), RoHS, Tape and Reel; Manufacturer: Yageo; Voltage Rating: 150 V; Temperature Coefficient: 100ppm/°C; Power Rating: 125mW; Mount: Surface Mount; ComponentLink1Description: Manufacturer URL; ComponentLink2URL: http://www.yageo.com/documents/recent/PYu-RC_Group_51_RoHS_L_04.pdf; Pins: 2; Length: 2 mm; Min Operating Temperature: -55 degC; Height: 0.5 mm; Mounting Technology: Surface Mount; RoHSCompliant: true; REACH SVHC: No SVHC; ComponentLink1URL: http://www.yageo.com/; Max Operating Temperature: 155 degC; PackageReference: 0805; DatasheetVersion: Rev. 4, 02/2016; Package Quantity: 5000; Packaging: Tape and Reel; ComponentLink2Description: Datasheet; PackageDescription: 2-Pin Surface Mounted Device, Body 2 x 1.25 mm; Supplier 1: Digi-Key; Supplier Part Number 1: 311-10.0KCRCT-ND; Manufacturer 1: Yageo; Manufacturer Part Number 1: RC0805FR-0710KL; RoHS: Yes; Category: Chip SMD Resistors; Stock 1: 5682818; Pricing 1: 1=0.10000, 10=0.03800, 100=0.01560, 1000=0.00702, 2500=0.00610 (USD); Case/Package: 0805; Case Code (Imperial): 0805; Case Code (Metric): 2012; Size Code: 0805; Tolerance: 1%; Resistor Type: Thick Film; Series: RC; Number of Terminations: 2; Max Power Dissipation: 125mW; Termination: SMD/SMT; Features: Moisture Resistant; Construction: Rectangular; Resistance Tolerance: 1%; Technology: THICK FILM; Width: 0.049inch; Depth: 1.25mm; RoHS Compliant: Yes; Military Standard: Not; Lead Free: Lead Free; ComponentLink3URL: https://datasheet.ciiva.com/11808/0900766b8106beab-11808151.pdf?src-supplier=RSComponents; ComponentLink3Description: https://datasheet.ciiva.com/11808/0900766b8106beab-11808151.pdf?src-supplier=RSComponents; ComponentLink4URL: https://datasheet.ciiva.com/46447/444164-46447563.pdf?src-supplier=Element14; ComponentLink4Description: https://datasheet.ciiva.com/46447/444164-46447563.pdf?src-supplier=Element14; ComponentLink5URL: https://datasheet.ciiva.com/2456/pyu-r-int-thick-7-2456973.pdf?src-supplier=Digi-Key; ComponentLink5Description: https://datasheet.ciiva.com/2456/pyu-r-int-thick-7-2456973.pdf?src-supplier=Digi-Key; ComponentLink6URL: https://datasheet.ciiva.com/2456/pyu-r-int-thick-7-2456974.pdf?src-supplier=Digi-Key; ComponentLink6Description: https://datasheet.ciiva.com/2456/pyu-r-int-thick-7-2456974.pdf?src-supplier=Digi-Key; ComponentLink7URL: https://datasheet.ciiva.com/2456/pyu-r-int-thick-7-2456972.pdf?src-supplier=Digi-Key; ComponentLink7Description: https://datasheet.ciiva.com/2456/pyu-r-int-thick-7-2456972.pdf?src-supplier=Digi-Key; ComponentLink8URL: https://datasheet.ciiva.com/12669/rc0805-12669688.pdf?src-supplier=Mouser; ComponentLink8Description: https://datasheet.ciiva.com/12669/rc0805-12669688.pdf?src-supplier=Mouser; ComponentLink9URL: https://datasheet.ciiva.com/16747/rc0805-16747087.pdf?src-supplier=Future+Electronics; ComponentLink9Description: https://datasheet.ciiva.com/16747/rc0805-16747087.pdf?src-supplier=Future+Electronics
SW200 SW201 = CMP-2000-05602-2: Swicth, SPST, 24 V, -35 to 85 degC, 4-Pin SMD, RoHS, Tape and Reel; Manufacturer: TE Connectivity; Switch Travel: 0.25mm; Mechanical Life: 100000Cycles; Contact Current Rating: 50mA; Operating Force: 1.57N; Actuator Material: Polyamide; Contact Resistance: 100mOhm; Voltage Rating: 24V; Illumination Type: Illuminated; Actuator Length: 0.055inch; Max Voltage Rating (DC): 12V; Case\/Package: SMD/SMT; Switch Function: Off-Mom; Actuator Type: Standard; Insulation Resistance: 100MR; Orientation: Straight; Datasheet URL: http://www.te.com/commerce/DocumentDelivery/DDEController?Action=showdoc&DocId=Customer+Drawing%7F2-1437565-7%7FV%7Fpdf%7FEnglish%7FENG_CD_2-1437565-7_V.pdf%7F4-1437565-2; Min Operating Temperature: -35degC; Packaging: LoosePiece; Termination: GullWing; Throw Configuration: SPST; Package Description: 4-Pin Surface Mount Device, Body 6 x 6 mm, Pitch 4.5 mm; Mounting Technology: SurfaceMount; Contact Plating: Silver; Datasheet Version: Rev. V, 02/2015; RoHSCompliant: true; Max Operating Temperature: 85degC; Length: 6mm; Voltage Rating (DC): 24V; Electrical Life: 100000Cycles; Current Rating: 50mA; Package Quantity: 750; Mount: SurfaceMount; Package Reference: FSM4JSMA; Manufacturer URL: http://www.te.com/; Width: 6mm; REACH SVHC: Unknown; Contact Material: CopperAlloy; Supplier 1: Digi-Key; Supplier Part Number 1: 450-1129-ND; Manufacturer 1: TE Connectivity; Manufacturer Part Number 1: FSM4JSMA; RoHS: Yes; Category: Pushbutton Switches; Stock 1: 65608; Pricing 1: 1=0.27000, 10=0.26300, 25=0.24960, 100=0.22600, 250=0.20604, 750=0.19152, 1500=0.16339, 3000=0.15885, 5250=0.14977 (USD); Case/Package: SMD/SMT; Color: Black; Series: FSMJSMA; Max Current Rating: 50mA; Depth: 10mm; Radiation Hardening: No; RoHS Compliant: Yes; Lead Free: Lead Free; ELV: Compliant
TP200-TP202 = CMP-1672-00008-1: as TP300 on sheet 03-Power; ComponentLink1Description: Manufacturer URL; Package Quantity: 1000; DatasheetVersion: 03/2014; Packaging: Tape and Reel; ComponentLink2URL: http://www.keyelco.com/product-pdf.cfm?p=1357; ComponentLink1URL: http://www.keyelco.com/; Mount: Surface Mount; Contact Plating: Silver; PackageDescription: 1-Pin Surface Mount Device, Body 3.81 x 2.03 mm; Pins: 1; RoHSCompliant: True; Mounting Technology: Surface Mount; ComponentLink2Description: Datasheet; PackageReference: 5019; Supplier 1: Digi-Key; Supplier Part Number 1: 36-5019CT-ND; Manufacturer Part Number 1: 5019; RoHS: Yes; Category: Connectors; Stock 1: 1316816; Pricing 1: 1=0.34000, 25=0.27360, 100=0.22340, 250=0.20064, 500=0.19152 (USD); Number of Pins: 1; Material: Bronze; Contact Material: Bronze; Series: 5019; Termination: SMD/SMT; Height: 0.09inch; RoHS Compliant: Yes; REACH SVHC: No SVHC; Lead Free: Lead Free; ComponentLink3URL: https://datasheet.ciiva.com/16318/m60-2p61-16318395.pdf?src-supplier=Future+Electronics; ComponentLink3Description: https://datasheet.ciiva.com/16318/m60-2p61-16318395.pdf?src-supplier=Future+Electronics; ComponentLink4URL: https://datasheet.ciiva.com/16885/70182998-16885945.pdf?src-supplier=Allied+Electronics; ComponentLink4Description: https://datasheet.ciiva.com/16885/70182998-16885945.pdf?src-supplier=Allied+Electronics; ComponentLink5URL: https://datasheet.ciiva.com/14848/m60-2p61-14848437.pdf?src-supplier=Digi-Key; ComponentLink5Description: https://datasheet.ciiva.com/14848/m60-2p61-14848437.pdf?src-supplier=Digi-Key; ComponentLink6URL: https://datasheet.ciiva.com/14848/m60-2p61-14848438.pdf?src-supplier=Digi-Key; ComponentLink6Description: https://datasheet.ciiva.com/14848/m60-2p61-14848438.pdf?src-supplier=Digi-Key; ComponentLink7URL: https://datasheet.ciiva.com/14848/m60-2p61-14848439.pdf?src-supplier=Digi-Key; ComponentLink7Description: https://datasheet.ciiva.com/14848/m60-2p61-14848439.pdf?src-supplier=Digi-Key
U200 U201 = CMP-04903-000082-1: IC GATE AND 1CH 2-INP SOT23-5; Manufacturer 1: Texas Instruments; Logic Function: AND GATE; RoHS Compliant: Yes; Supplier 1: Digi-Key; Supplier Part Number 1: 296-SN74AHC1G08DBV3CT-ND; Manufacturer Part Number 1: SN74AHC1G08DBV3; RoHS: Yes; Category: Logic Gates; Stock 1: 11940; Pricing 1: 1=0.53000, 10=0.42800, 25=0.39200, 100=0.29170, 250=0.26436, 500=0.21878, 1000=0.16409 (USD); ComponentLink1URL: http://www.ti.com/general/docs/suppproductinfo.tsp?distId=10&amp;gotoUrl=http%3A%2F%2Fwww.ti.com%2Flit%2Fgpn%2Fsn74ahc1g08&src-supplier=Digi-Key; ComponentLink1Description: http://www.ti.com/general/docs/suppproductinfo.tsp?distId=10&amp;gotoUrl=http%3A%2F%2Fwww.ti.com%2Flit%2Fgpn%2Fsn74ahc1g08&src-supplier=Digi-Key
Y200 = CMP-2000-07587-2: CRYSTAL 32.7680KHZ 6PF SMD; Manufacturer 1: Abracon; Manufacturer Part Number 1: ABS07-120-32.768KHZ-T; Frequency Tolerance: 20ppm; Series Resistance: 60kR; ESR (Equivalent Series Resistance): 55kR; Depth: 1.5mm; Width: 0.061inch; Number of Pins: 2; Max Operating Temperature: 85°C; Length: 3.2mm; Case/Package: SMD/SMT; Series: ABS07; Lead Free: Lead Free; Min Operating Temperature: -40°C; Load Capacitance: 6pF; Packaging: Tape and Reel; Height: 0.035inch; Radiation Hardening: No; Tolerance: 20ppm; Operating Frequency: 32.768 kHz; Termination: SMD/SMT; REACH SVHC: No SVHC; RoHS Compliant: Yes; Frequency: 32.768kHz; Package Quantity: 3000; Mount: Surface Mount; Supplier 1: Digi-Key; Supplier Part Number 1: 535-11937-1-ND; RoHS: Yes; Category: Crystals; Stock 1: 273340; Pricing 1: 1=1.20000, 10=1.15000, 50=1.12340, 100=0.96290, 500=0.93616, 1000=0.78905 (USD); ComponentLink1URL: https://datasheet.ciiva.com/6728/abs07-120-32-768khz-t-6728893.pdf?src-supplier=Digi-Key; ComponentLink1Description: https://datasheet.ciiva.com/6728/abs07-120-32-768khz-t-6728893.pdf?src-supplier=Digi-Key; ComponentLink2URL: https://datasheet.ciiva.com/12387/abs07-120-32-768khz-t-218607-12387629.pdf?src-supplier=Mouser; ComponentLink2Description: https://datasheet.ciiva.com/12387/abs07-120-32-768khz-t-218607-12387629.pdf?src-supplier=Mouser; ComponentLink3URL: https://datasheet.ciiva.com/15214/getdatasheetpartid-722402-15214953.pdf?src-supplier=Verical; ComponentLink3Description: https://datasheet.ciiva.com/15214/getdatasheetpartid-722402-15214953.pdf?src-supplier=Verical